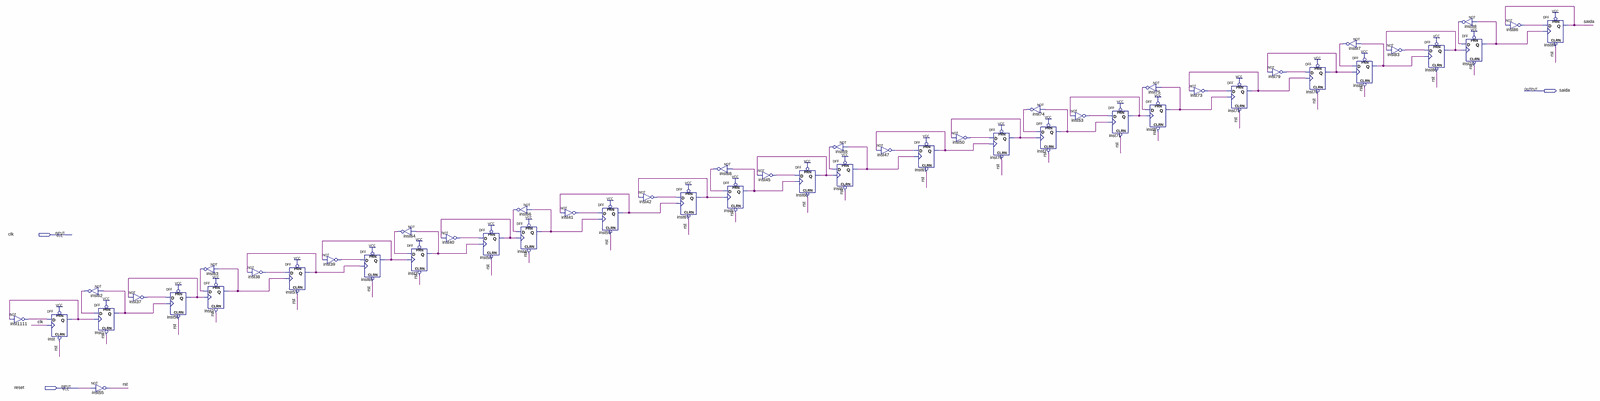
[diagram p0: schematic sheet, whole]
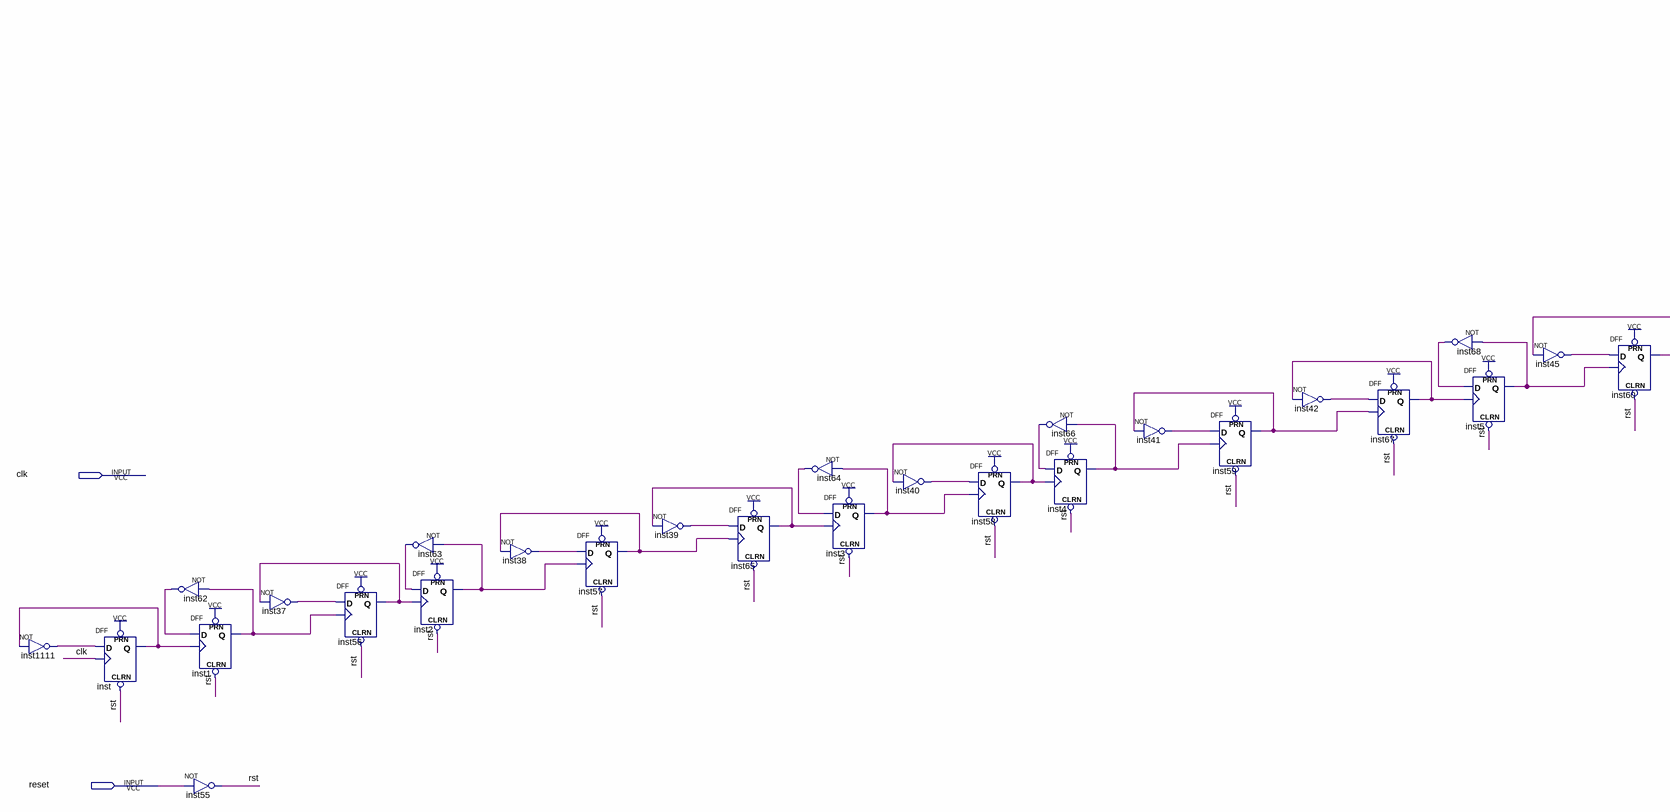
[diagram p1: schematic sheet, left part]
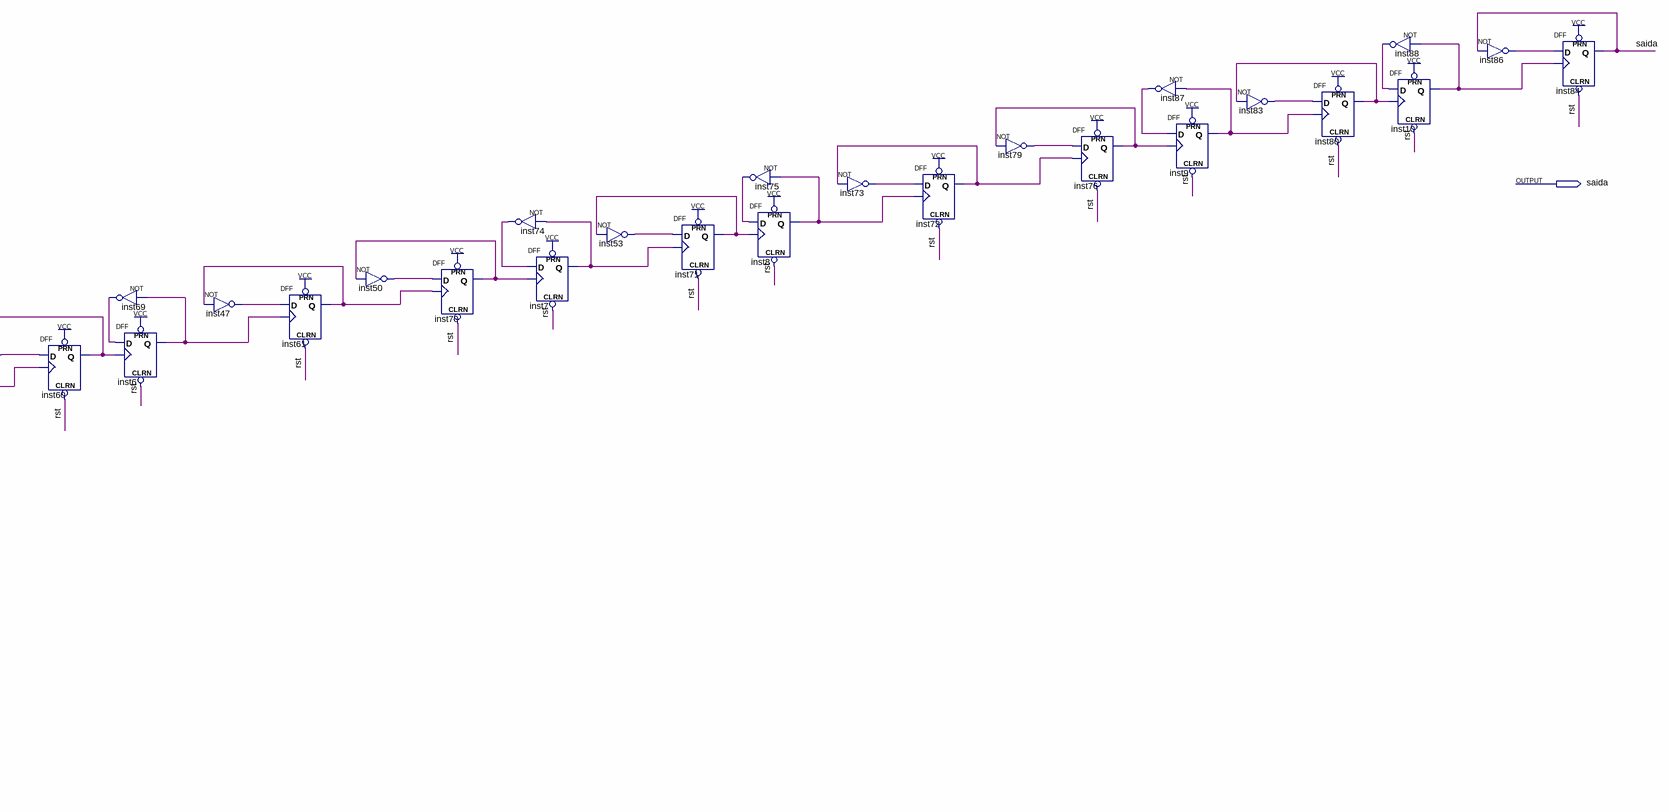
[diagram p2: schematic sheet, right part]
// Quartus schematic divfreq.bdf as structural Verilog: 51 symbols, 3 pins
module divfreq (
  input  clk,
  input  reset,
  output saida
);

  wire inst1_q, inst2_q, inst3_q, inst4_q, inst5_q, inst6_q, inst7_q, inst8_q, inst9_q, inst10_q, inst37_out,
       inst38_out, inst39_out, inst40_out, inst41_out, inst42_out, inst45_out, inst47_out, inst50_out,
       inst53_out, inst56_q, inst57_q, inst58_q, inst59_q, inst60_q, inst61_q, inst62_out, inst63_out,
       inst64_out, inst65_q, inst66_out, inst67_q, inst68_out, inst69_out, inst70_q, inst71_q, inst72_q,
       inst73_out, inst74_out, inst75_out, inst76_q, inst79_out, inst80_q, inst83_out, inst86_out,
       inst87_out, inst88_out, inst1111_out, inst_q, rst;

  not inst1111 (inst1111_out, inst_q);
  DFF inst (.CLRN(rst), .CLK(clk), .D(inst1111_out), .PRN(1'b1), .Q(inst_q));
  not inst62 (inst62_out, inst1_q);
  not inst55 (rst, reset);
  DFF inst1 (.CLRN(rst), .CLK(inst_q), .D(inst62_out), .PRN(1'b1), .Q(inst1_q));
  not inst37 (inst37_out, inst56_q);
  DFF inst56 (.CLRN(rst), .CLK(inst1_q), .D(inst37_out), .PRN(1'b1), .Q(inst56_q));
  not inst63 (inst63_out, inst2_q);
  DFF inst2 (.CLRN(rst), .CLK(inst56_q), .D(inst63_out), .PRN(1'b1), .Q(inst2_q));
  not inst38 (inst38_out, inst57_q);
  DFF inst57 (.CLRN(rst), .CLK(inst2_q), .D(inst38_out), .PRN(1'b1), .Q(inst57_q));
  not inst39 (inst39_out, inst65_q);
  DFF inst65 (.CLRN(rst), .CLK(inst57_q), .D(inst39_out), .PRN(1'b1), .Q(inst65_q));
  not inst64 (inst64_out, inst3_q);
  DFF inst3 (.CLRN(rst), .CLK(inst65_q), .D(inst64_out), .PRN(1'b1), .Q(inst3_q));
  not inst40 (inst40_out, inst58_q);
  DFF inst58 (.CLRN(rst), .CLK(inst3_q), .D(inst40_out), .PRN(1'b1), .Q(inst58_q));
  not inst66 (inst66_out, inst4_q);
  DFF inst4 (.CLRN(rst), .CLK(inst58_q), .D(inst66_out), .PRN(1'b1), .Q(inst4_q));
  not inst41 (inst41_out, inst59_q);
  DFF inst59 (.CLRN(rst), .CLK(inst4_q), .D(inst41_out), .PRN(1'b1), .Q(inst59_q));
  not inst42 (inst42_out, inst67_q);
  DFF inst67 (.CLRN(rst), .CLK(inst59_q), .D(inst42_out), .PRN(1'b1), .Q(inst67_q));
  not inst68 (inst68_out, inst5_q);
  DFF inst5 (.CLRN(rst), .CLK(inst67_q), .D(inst68_out), .PRN(1'b1), .Q(inst5_q));
  not inst45 (inst45_out, inst60_q);
  DFF inst60 (.CLRN(rst), .CLK(inst5_q), .D(inst45_out), .PRN(1'b1), .Q(inst60_q));
  not inst69 (inst69_out, inst6_q);
  DFF inst6 (.CLRN(rst), .CLK(inst60_q), .D(inst69_out), .PRN(1'b1), .Q(inst6_q));
  not inst47 (inst47_out, inst61_q);
  DFF inst61 (.CLRN(rst), .CLK(inst6_q), .D(inst47_out), .PRN(1'b1), .Q(inst61_q));
  not inst50 (inst50_out, inst70_q);
  DFF inst70 (.CLRN(rst), .CLK(inst61_q), .D(inst50_out), .PRN(1'b1), .Q(inst70_q));
  not inst74 (inst74_out, inst7_q);
  DFF inst7 (.CLRN(rst), .CLK(inst70_q), .D(inst74_out), .PRN(1'b1), .Q(inst7_q));
  not inst53 (inst53_out, inst71_q);
  DFF inst71 (.CLRN(rst), .CLK(inst7_q), .D(inst53_out), .PRN(1'b1), .Q(inst71_q));
  not inst75 (inst75_out, inst8_q);
  DFF inst8 (.CLRN(rst), .CLK(inst71_q), .D(inst75_out), .PRN(1'b1), .Q(inst8_q));
  not inst73 (inst73_out, inst72_q);
  DFF inst72 (.CLRN(rst), .CLK(inst8_q), .D(inst73_out), .PRN(1'b1), .Q(inst72_q));
  not inst79 (inst79_out, inst76_q);
  DFF inst76 (.CLRN(rst), .CLK(inst72_q), .D(inst79_out), .PRN(1'b1), .Q(inst76_q));
  not inst87 (inst87_out, inst9_q);
  DFF inst9 (.CLRN(rst), .CLK(inst76_q), .D(inst87_out), .PRN(1'b1), .Q(inst9_q));
  not inst83 (inst83_out, inst80_q);
  DFF inst80 (.CLRN(rst), .CLK(inst9_q), .D(inst83_out), .PRN(1'b1), .Q(inst80_q));
  not inst88 (inst88_out, inst10_q);
  DFF inst10 (.CLRN(rst), .CLK(inst80_q), .D(inst88_out), .PRN(1'b1), .Q(inst10_q));
  not inst86 (inst86_out, saida);
  DFF inst84 (.CLRN(rst), .CLK(inst10_q), .D(inst86_out), .PRN(1'b1), .Q(saida));
endmodule
